# EasyEDA schematic SCH_Blinking-Maple-PCB_2025-10-30.json
TITLE: Sheet_1; REV: 1.0; Date: 2025-10-30; Sheet: 1/1; Drawn By: paulndeh86; Company: Your Company
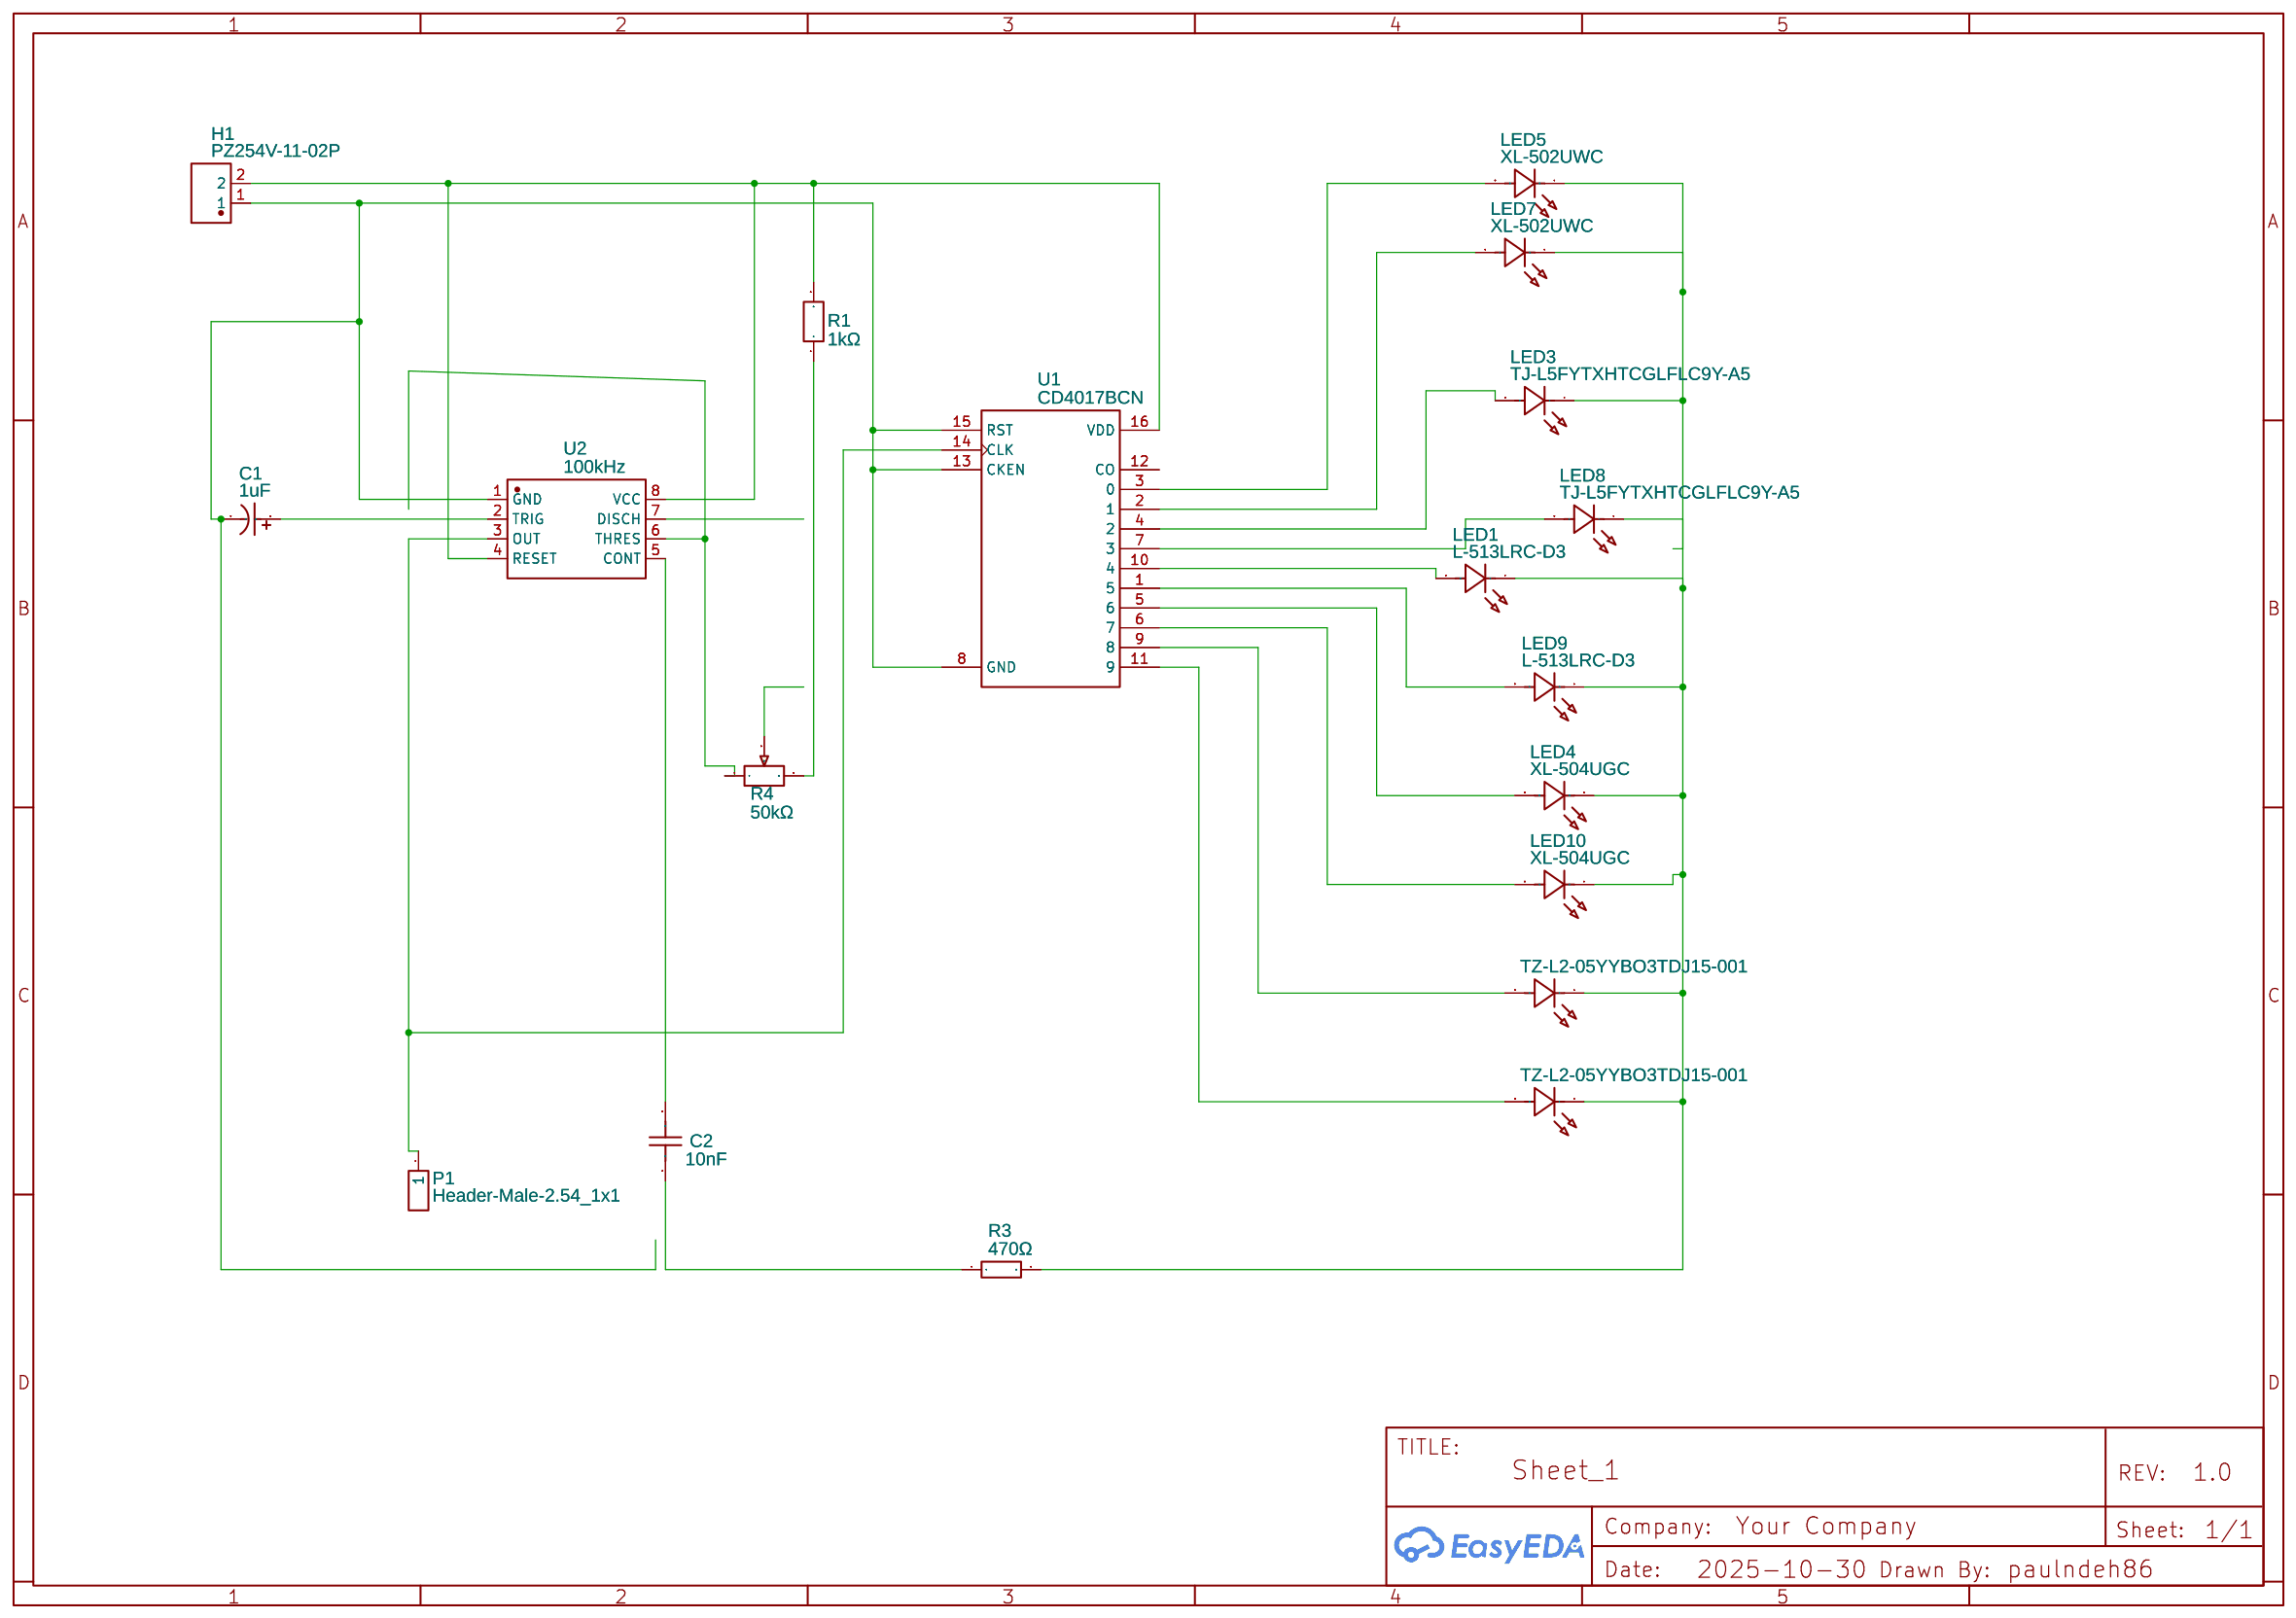
[diagram p0: schematic sheet]

## Parts
C1  1uF  [CAP-TH_BD5.0-P2.00-D0.8-FD]
C2  10nF  [CAP-TH_L8.0-W4.0-P5.00-D1.2]
H1  PZ254V-11-02P  [HDR-TH_2P-P2.54-V-M]
LED1  L-513LRC-D3  [LED-TH_BD5.0-P2.54-L-RD_WHITE]
LED2  TZ-L2-05YYBO3TDJ15-001  [LED-TH_BD5.8-P2.54-L-RD]
LED3  TJ-L5FYTXHTCGLFLC9Y-A5  [LED-TH_BD5.8-P2.54-L-RD]
LED4  XL-504UGC  [LED-TH_BD5.9-P2.54-RD_GREEN]
LED5  XL-502UWC  [LED-TH_BD5.9-P2.54-RD_WHITE]
LED7  XL-502UWC  [LED-TH_BD5.9-P2.54-RD_WHITE]
LED8  TJ-L5FYTXHTCGLFLC9Y-A5  [LED-TH_BD5.8-P2.54-L-RD]
LED9  L-513LRC-D3  [LED-TH_BD5.0-P2.54-L-RD_WHITE]
LED10  XL-504UGC  [LED-TH_BD5.9-P2.54-RD_GREEN]
LED11  TZ-L2-05YYBO3TDJ15-001  [LED-TH_BD5.8-P2.54-L-RD]
P1  Header-Male-2.54_1x1  [HDR-TH_1P-P2.54-V-M]
R1  1kΩ  [RES-TH_BD2.3-L6.5-P10.50-D0.5]
R3  470Ω  [RES-TH_BD2.2-L6.5-P10.50-D0.6]
R4  50kΩ  [RES-ADJ-TH_3P-L3.4-W3.4-BR]
U1  CD4017BCN  [DIP16]
U2  100kHz  [DIP-8_L9.8-W6.6-P2.54-LS7.6-BL]

## Library data of the parts
C1 = KF010M050C110A: Supplier: LCSC; Manufacturer: CapXon(丰宾); Supplier Part: C62934; JLCPCB Part Class: Extended Part
C2 = N09F1B103MN0B0S0N0: Contributor: LCSC; Supplier: LCSC; Supplier Part: C249157; Manufacturer: STE(松田); JLCPCB Part Class: Extended Part
H1 = PZ254V-11-02P: Contributor: LCSC; Supplier: LCSC; Supplier Part: C492401; Manufacturer: XFCN(兴飞); JLCPCB Part Class: Extended Part
LED1 LED9 = L-513LRC-D3: Contributor: LCSC; Supplier: LCSC; Supplier Part: C2844743; Manufacturer: PARALIGHT(光鼎); JLCPCB Part Class: Extended Part
LED2 LED11 = TZ-L2-05YYBO3TDJ15-001: Contributor: LCSC; Supplier: LCSC; Supplier Part: C779445; Manufacturer: TUOZHAN(拓展光电); JLCPCB Part Class: Extended Part
LED3 LED8 = TJ-L5FYTXHTCGLFLC9Y-A5: Contributor: LCSC; Supplier: LCSC; Supplier Part: C330770; Manufacturer: TOGIALED(统佳); JLCPCB Part Class: Extended Part
LED4 LED10 = XL-504UGC: Contributor: lcsc; Supplier: LCSC; Supplier Part: C2895483; Manufacturer: XINGLIGHT(成兴光); JLCPCB Part Class: Extended Part
LED5 LED7 = XL-502UWC: Contributor: LCSC; Supplier: LCSC; Supplier Part: C2895480; Manufacturer: XINGLIGHT(成兴光); JLCPCB Part Class: Extended Part
P1 = Header-Male-2.54_1x1: Supplier: LCSC; Manufacturer: BOOMELE(博穆精密); Manufacturer Part: 2.54-1*1P针; Supplier Part: C81276; JLCPCB Part Class: Extended Part
R1 = MF1/4W-1KΩ±1%T52: Contributor: LCSC; Supplier: LCSC; Supplier Part: C713997; Manufacturer: 华星机电; JLCPCB Part Class: Extended Part
R3 = MFR0W4F4700A50: Supplier: LCSC; Manufacturer: UNI-ROYAL(厚声); Supplier Part: C58592; JLCPCB Part Class: Extended Part
R4 = ST-32EA 50K ohm (503): Resistance(Ohms): 50K; Contributor: LCSC; Supplier: LCSC; Supplier Part: C132893; Manufacturer: NIDEC(尼得科); JLCPCB Part Class: Extended Part
U1 = CD4017BCN: Decade CounterDivider with 10 Decoded Outputs
U2 = NE555P: Supplier: LCSC; Manufacturer: TI(德州仪器); Supplier Part: C46749; JLCPCB Part Class: Extended Part

## Nets
Net-(C1-1): C1.1 U2.2(TRIG)
Net-(C1-2): C1.2 H1.1 U1.8(GND) U1.13(CKEN) U1.15(RST) U2.1(GND)
Net-(C2-1): C2.1 R3.1
Net-(C2-2): C2.2 U2.5(CONT)
Net-(H1-2): H1.2 R1.2 U1.16(VDD) U2.4(RESET) U2.8(VCC)
Net-(LED1-1): LED1.1(K) LED2.1(-) LED4.1(K) LED8.1(-) LED9.1(K) LED10.1(K) LED11.1(-) R3.2
Net-(LED1-2): LED1.2(A) U1.10(4)
Net-(LED2-2): LED2.2(+) U1.9(8)
Net-(LED3-1): LED3.1(-) LED5.1(K) LED7.1(K)
Net-(LED3-2): LED3.2(+) U1.4(2)
Net-(LED4-2): LED4.2(A) U1.5(6)
Net-(LED5-2): LED5.2(A) U1.3(0)
Net-(LED7-2): LED7.2(A) U1.2(1)
Net-(LED8-2): LED8.2(+) U1.7(3)
Net-(LED9-2): LED9.2(A) U1.1(5)
Net-(LED10-2): LED10.2(A) U1.6(7)
Net-(LED11-2): LED11.2(+) U1.11(9)
Net-(P1-1): P1.1 U1.14(CLK) U2.3(OUT)
Net-(R1-1): R1.1 R4.3
Net-(R4-1): R4.1 U2.6(THRES)

Not connected (* = marked no-connect by the designer): R4 2; U1 12(CO); U2 7(DISCH)
